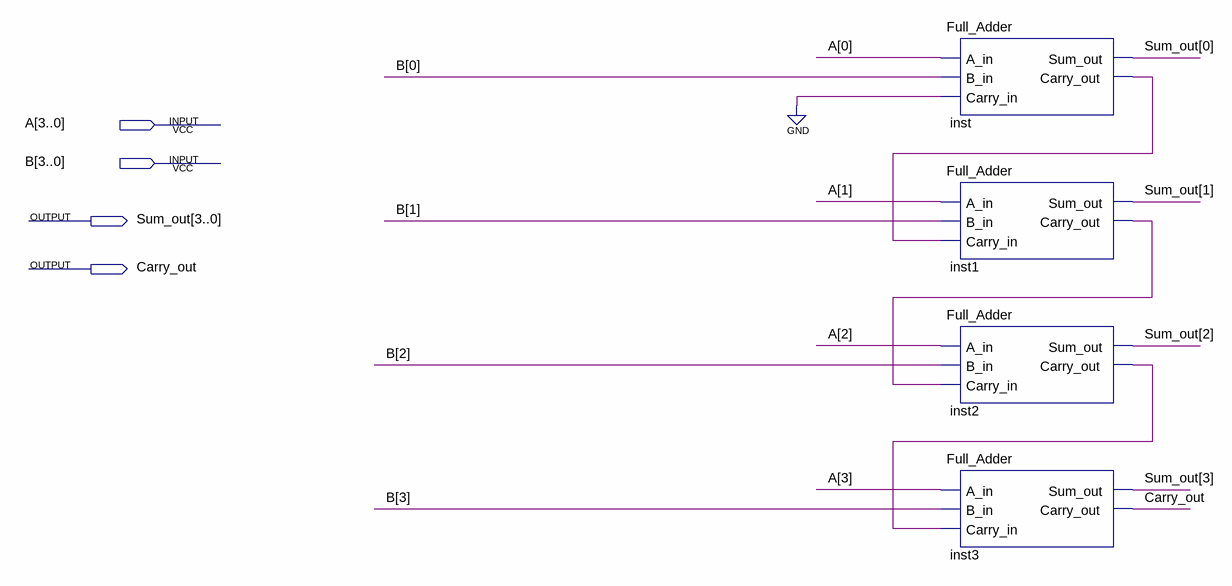
[diagram p0: schematic sheet]
// Quartus schematic Full_Adder_4_Bit.bdf as structural Verilog: 4 symbols, 4 pins
module Full_Adder_4_Bit (
  input  [3:0] A,
  input  [3:0] B,
  output [3:0] Sum_out,
  output Carry_out
);

  wire inst1_carry_out, inst2_carry_out, inst_carry_out;

  Full_Adder inst (.A_in(A[0]), .B_in(B[0]), .Carry_in(1'b0), .Sum_out(Sum_out[0]), .Carry_out(inst_carry_out));
  Full_Adder inst1 (
    .A_in(A[1]), .B_in(B[1]), .Carry_in(inst_carry_out), .Sum_out(Sum_out[1]), .Carry_out(inst1_carry_out));
  Full_Adder inst2 (
    .A_in(A[2]), .B_in(B[2]), .Carry_in(inst1_carry_out), .Sum_out(Sum_out[2]), .Carry_out(inst2_carry_out));
  Full_Adder inst3 (.A_in(A[3]), .B_in(B[3]), .Carry_in(inst2_carry_out), .Sum_out(Sum_out[3]), .Carry_out(Carry_out));
endmodule
